# EAGLE design Adafruit PowerBoost 500C (EAGLE 6.3)
COMPANY: ADAFRUIT INDUSTRIES; DRAWN: KTOWN; REV: A
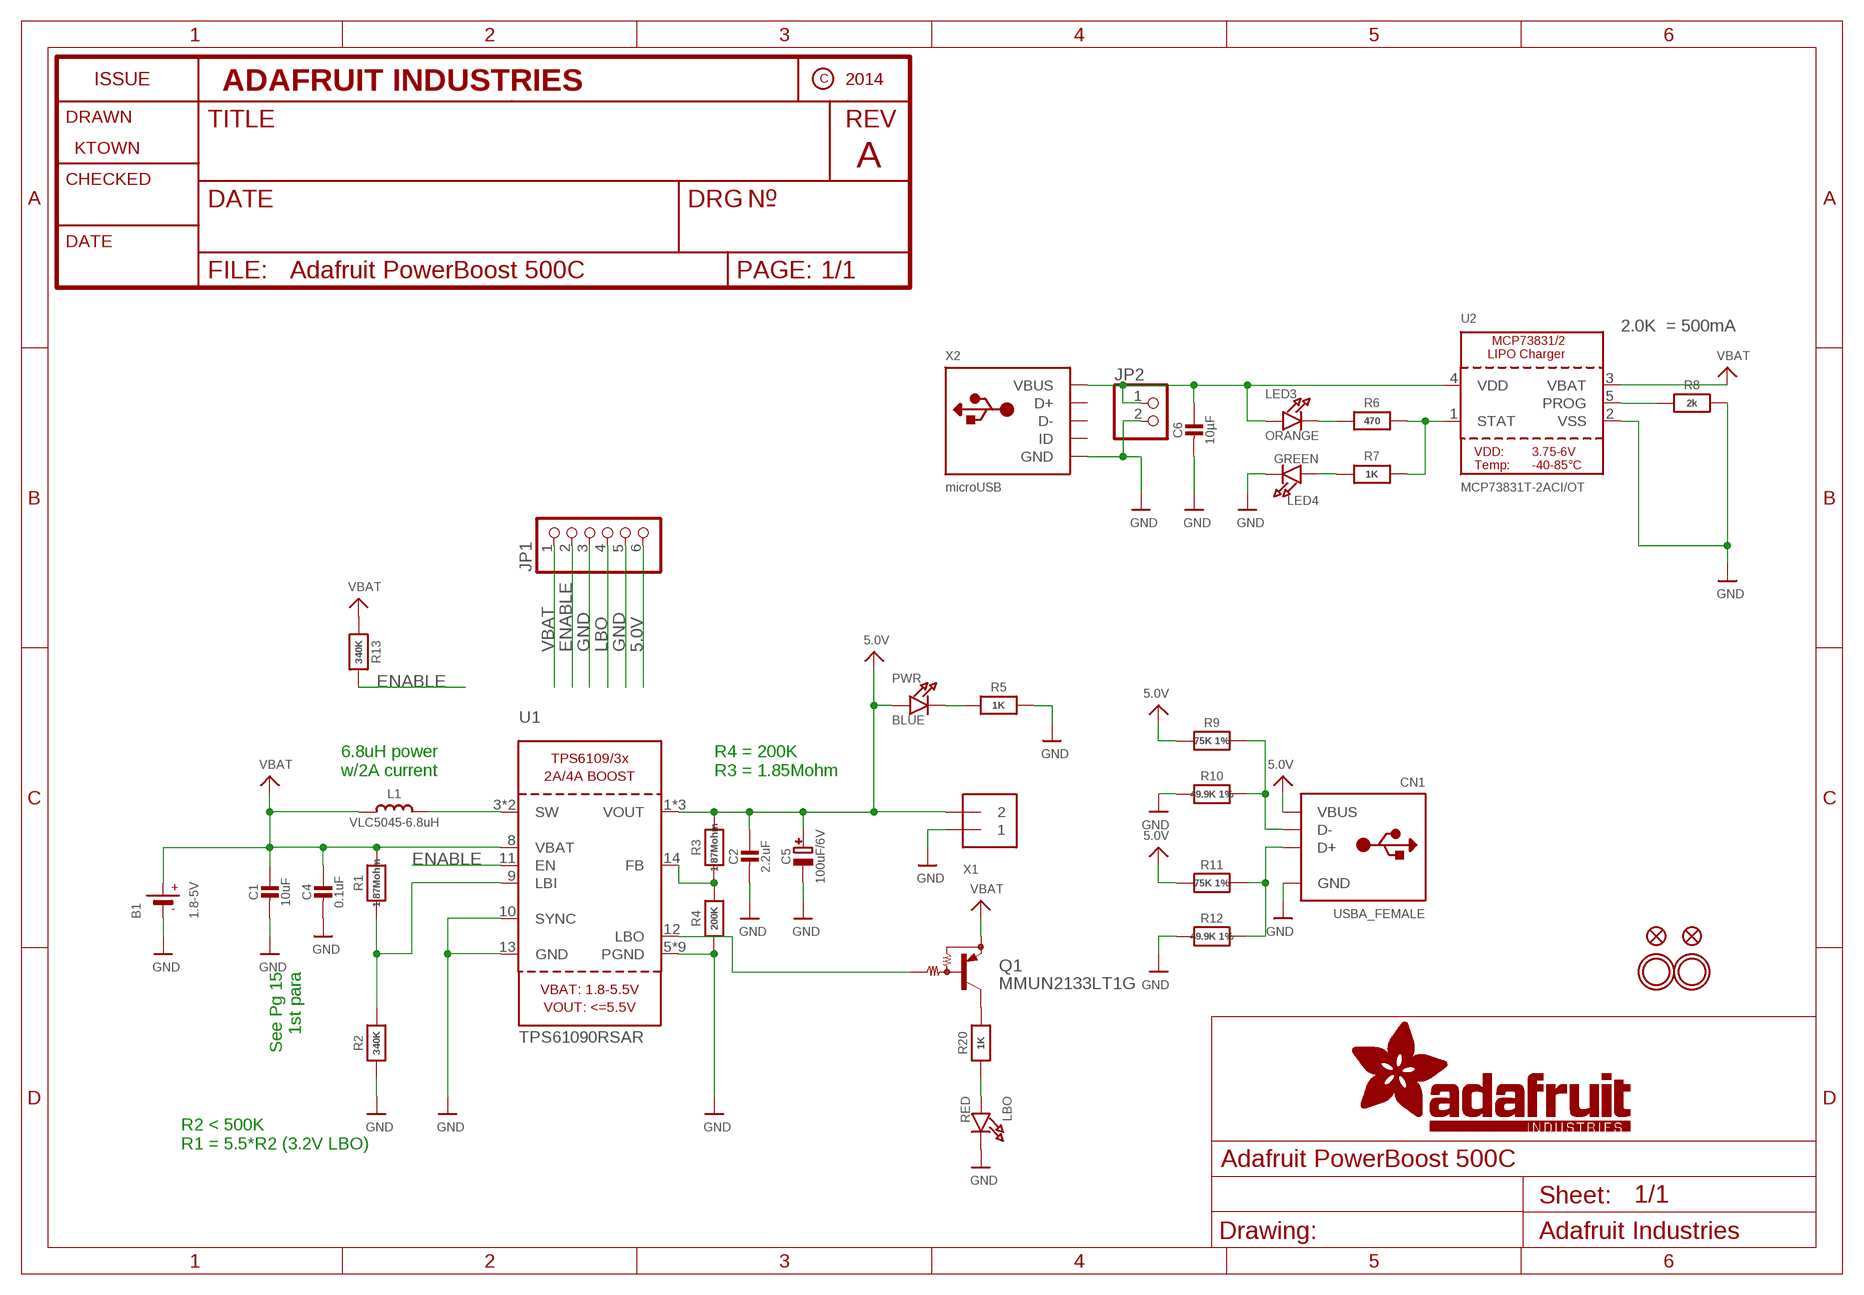
[diagram p0: schematic, sheet 1]

## Parts
B1  1.8-5V  BATTERY  [JSTPH2]
C1  10uF  CAP_CERAMIC0805-NOOUTLINE  [0805-NO]
C2  2.2uF  CAP_CERAMIC0805-NOOUTLINE  [0805-NO]
C4  0.1uF  CAP_CERAMIC0805-NOOUTLINE  [0805-NO]
C5  100uF/6V  CAP_TANTALUMB/3528_REFLOW  [EIA3528-21/B-R]
C6  10µF  CAP_CERAMIC0805-NOOUTLINE  [0805-NO]
CN1  USBA_FEMALE  USB_TYPEAPTHFML  [USB_HOST-PTH]
FID2  FIDUCIAL""  [FIDUCIAL_1MM]
FID3  FIDUCIAL""  [FIDUCIAL_1MM]
JP1  PINHD-1X6CB  [1X06-CLEANBIG]
JP2  HEADER-1X2ROUND  [1X02_ROUND]
L1  VLC5045-6.8uH  INDUCTORTDK_VLC5045  [INDUCTOR_5X5MM_TDK_VLC5045]
LBO  RED  LED0805_NOOUTLINE  [CHIPLED_0805_NOOUTLINE]
LED3  ORANGE  LED0805_NOOUTLINE  [CHIPLED_0805_NOOUTLINE]
LED4  GREEN  LED0805_NOOUTLINE  [CHIPLED_0805_NOOUTLINE]
PWR  BLUE  LED0805_NOOUTLINE  [CHIPLED_0805_NOOUTLINE]
Q1  MMUN2133LT1G  MUN2114T1-PNP_DRIVER-SC59-BEC  [SC59-BEC]
R1  1.87Mohm  RESISTOR0805_NOOUTLINE  [0805-NO]
R2  340K  RESISTOR0805_NOOUTLINE  [0805-NO]
R3  1.87Mohm  RESISTOR0805_NOOUTLINE  [0805-NO]
R4  200K  RESISTOR0805_NOOUTLINE  [0805-NO]
R5  1K  RESISTOR0805_NOOUTLINE  [0805-NO]
R6  470  RESISTOR0805_NOOUTLINE  [0805-NO]
R7  1K  RESISTOR0805_NOOUTLINE  [0805-NO]
R8  2k  RESISTOR0805_NOOUTLINE  [0805-NO]
R9  75K 1%  RESISTOR0805_NOOUTLINE  [0805-NO]
R10  49.9K 1%  RESISTOR0805_NOOUTLINE  [0805-NO]
R11  75K 1%  RESISTOR0805_NOOUTLINE  [0805-NO]
R12  49.9K 1%  RESISTOR0805_NOOUTLINE  [0805-NO]
R13  340K  RESISTOR0805_NOOUTLINE  [0805-NO]
R20  1K  RESISTOR0805_NOOUTLINE  [0805-NO]
U1  TPS61090RSAR  VREG_TPS6103X  [PVQFN-16]
U2  MCP73831T-2ACI/OT  MCP73831/2  [SOT23-5]
U$10  MOUNTINGHOLE2.5  [MOUNTINGHOLE_2.5_PLATED]
U$12  MOUNTINGHOLE2.5  [MOUNTINGHOLE_2.5_PLATED]
X1  TERMBLOCK_1X2  [TERMBLOCK_1X2-3.5MM]
X2  microUSB  USBMICRO_20329  [4UCONN_20329]

## Nets
5.0V: C2.1 C5.+ CN1.VBUS JP1.6 PWR.A R3.2 R9.2 R11.2 U1.1(VOUT) U1.15(VOUT) U1.16(VOUT) X1.2
D+: CN1.D+ R11.1 R12.1
D-: CN1.D- R9.1 R10.1
ENABLE: JP1.2 R13.2 U1.11(EN)
GND: B1.1(-) C1.2 C2.2 C4.2 C5.- C6.2 CN1.GND JP1.3 JP1.5 JP2.2 LBO.C LED4.C R2.1 R4.1 R5.2 R8.2 R10.2 R12.2 U1.5(PGND) U1.6(PGND) U1.7(PGND) U1.10(SYNC) U1.13(GND) U1.P$18(PGND) U1.P$19(PGND) U1.P$20(PGND) U1.P$21(PGND) U1.P$22(PGND) U1.THERMAL(PGND) U2.2(VSS) X1.1 X2.BASE@1(GND) X2.BASE@2(GND) X2.GND X2.SPRT@1(GND) X2.SPRT@2(GND) X2.SPRT@3(GND) X2.SPRT@4(GND)
LBO: JP1.4 Q1.B U1.12(LBO)
N$1: L1.P$2 U1.3(SW) U1.4(SW)
N$2: LBO.A R20.1
N$3: R1.1 R2.2 U1.9(LBI)
N$4: PWR.C R5.1
N$5: R3.1 R4.2 U1.14(FB)
N$6: LED3.C R6.1
N$7: R6.2 R7.2 U2.1(STAT)
N$8: R8.1 U2.5(PROG)
N$9: LED4.A R7.1
N$10: Q1.C R20.2
VBAT: B1.2(+) C1.1 C4.1 JP1.1 L1.P$1 Q1.E R1.2 R13.1 U1.8(VBAT) U2.3(VBAT)
VDD1: C6.1 JP2.1 LED3.A U2.4(VDD) X2.VBUS
Unconnected: X2.D+ X2.D- X2.ID

## Notes on the sheet
- 2.0K  = 500mA
- 6.8uH power
  w/2A current
- R4 = 200K
  R3 = 1.85Mohm
- See Pg 15
  1st para
- R2 < 500K
  R1 = 5.5*R2 (3.2V LBO)

## Library data of the parts
B1 = microbuilder:BATTERY: CR1220 SMT - Digikey: 3001K-ND CD2032 BAT-HLD-001 - Digikey: BAT-HLD-001-ND
C1 C2 C4 C6 = microbuilder:CAP_CERAMIC: Ceramic Capacitors For new designs, use the packages preceded by an '_' character since they are more reliable: The following footprints should be used on most boards: _0402 - Standard footprint for regular board layouts _0603 - Standard footprint for regular board layouts _0805 - Standard footprint for regular board layouts _1206 - Standard footprint for regular board layouts For extremely tight-pitch boards where space is at a premium, the following 'micro-pitch' footprints can be used (smaller pads, no silkscreen outline, etc.): _0402MP - Micro-pitch footprint for very dense/compact boards _0603MP - Micro-pitch footprint for very dense/compact boards _0805MP - Micro-pitch footprint for very dense/compact boards _1206MP - Micro-pitch footprint for very dense/compact boards
C5 = microbuilder:CAP_TANTALUM: Tantalum Capacitors Wave footprints have larger pads and are meant to be used for hand soldering. Reflow footprints are optimised for solder paste and a reflow oven. EIA3216-18/A-[R/W] - Size A / 3216-18 / 1206 footprint 4.7µF 25V 10% Tantalum Capacitor 10µF 16V 10% Tantalum Capacitor [Digikey: 495-2236-2-ND] EIA3528-21/B-[R/W] - Size B / 3528-21 47µF 10V 10% Tantalum Capactior [Digikey: 495-2216-1-ND] EIA6032-28/C-[R/W] - Size C / 6032-28 10µF 35V 20% Tantalum Capacitor [Digikey: 495-2285-1-ND] 100µF 16V 10% Tantalum Capactior [Digikey: 399-5214-1-ND]
CN1 = microbuilder:USB_TYPEA: USB - Type A Connectors Male types stick out and are inserted into a PC or matching females parts (these are the connectors used on USB Memory Sticks, etc.). Female parts are generally used for USB Host and accept a male-type connector. SMT - 4UCON: 10017 PTHFML - Digikey: 609-1045-ND, 4UCon: 05241 PCB - Use 2.0mm thick PCBs with this footprint
FID2 FID3 = microbuilder:FIDUCIAL: Fiducial Alignment Points Various fiducial points for machine vision alignment.; BOM: EXCLUDE
JP1 = adafruit:PINHD-1X6: PIN HEADER
JP2 = microbuilder:HEADER-1X2: PIN HEADER
L1 = microbuilder:INDUCTOR: Inductors 0603: 10nH Ceramic Inductor - microwire antenna/RF (Digikey: 712-1434-2-ND) 0805: 560nH Ceramic Inductor - RF (Digikey: 553-1047-1-ND) 270nH Ceramic Inductor - Q = 40@250MHz, +-5%, 1 Ohm DC Resistance (Digikey: 535-10506-2-ND) 1007 (2518 Metric) SMT: 10µH 10% 250mOhm 820mA 1007 Inductor (Digikey: 587-2189-1-ND) 22µH 10% 500mOhm 580mA 1007 Inductor (Digikey: 587-2190-1-ND) 47µH 10% 950mOhm 420mA 1007 Inductor (Digikey: 587-2191-1-ND) 47µH 5% 100mOhm 1A 1008 Inductor (Digikey: 732-1816-1-ND) 5.0x5.0mm (Taiyo Yuden NR5040 Series) 6.8µH 20% 2.3A 64mOhm Inductor (Digikey: 587-2374-2-ND) 5.0x5.0mm (TDK VLC5045 Series) 4.7µH 20% 3.3A 34mOhm Inductor (Digikey: 445-6526-1-ND) 6.8µH 20% 2.7A 46mOhm Inductor (Digikey: 445-6527-1-ND) 6.0x6.0mm (TDK VLC6045 Series) 4.7µH 20% 3.8A 27mOhm Inductor (Digikey: 445-6538-2-ND) 6.8µH 20% 3A 41mOhm Inductor (Digikey: 445-6540-1-ND) 6.2µH 30% 2.2A 45mOhm Inductor (Digikey: SRR5028-6R2YCT-ND) - Not TDK VLC6045 but footprint should match 6.0x6.0mm (TDK SLF6045 Series) 6.8uH 30% 2A 33mOhm Inductor (Digikey: 445-4572-1-ND, Mouser: 810-SLF645T6R8N2R0PF) 6.0x6.0mm (Sumida CDRH5D28 Series) 6.2uH 30% 1.8A 45mOhm Inductor (Digikey: 308-1542-1-ND) Taiyo Yuden NR3015T2R2M - 2.2uH 20% 1.5A (Digikey: 587-1648-2-ND, Mouser: 963-NR3015T2R2M) - Used with TI TPS62172 CoilCraft RFID Transponder Coil - MA5532-AE (For use with AS3935 Lightning Sensor)
LBO LED3 LED4 PWR = microbuilder:LED: LED 0603 - 0603 Surface Mount Package 2mA: Green LED - Low Power (3.9mcd, 2ma, 1.7Vf) - Digikey: 475-2709-2-ND Orange LED - Low Power (9.8mcd, 2ma, 1.8Vf) - Digikey: 475-1194-2-ND Red LED - Low Power (5mcd, 2ma, 1.8Vf) - Digikey: 475-1195-2-ND Yellow LED - Low Power (7mcd, 2ma, 1.8Vf) - Digikey: 475-1196-2-ND 5mA: Blue LED - Low Power (17mcd, 5ma, 2.9Vf) - Digikey: LNJ937W8CRACT-ND 0805 - 0805 Surface Mount Package 2mA: Red LED (8.8mcd, 2mA, 1.8Vf, Clear) - Low Power [Digikey: 475-2510-1-ND] Green LED (5mcd, 2mA, 1.8Vf, Clear) - Low Power [Digikey: 475-2730-1-ND] Yellow LED (11.3mcd, 2mA, 1.8Vf, Clear) - Low Power [Digikey: 475-2555-1-ND] 20mA: Red LED (104mcd, 20mA, Diffused) - LS R976 [Digikey: 475-1278-6-ND] Red LED (12mcd, 20mA, 2.0Vf, Clear) - APT2012EC [Digikey: 754-1128-1-ND] Green LED (15mcd, 20mA, 2.2Vf, Clear) - APT2012GC [Digikey: 754-1131-1-ND] Orange LED (160mcd, 20mA, 2.1Vf, Clear) - APT2012SECK [Digikey: 754-1130-1-ND] 1206 - 1206 Surface Mount Package Green LED (26mcd, 20mA, Diffused) - LG N971 [Digikey: 475-1407-6-ND] Red LED (15mcd, 20mA, Diffused) - LH N974 [Digikey: 475-1416-6-ND] Cree - Cree High-Power Surface Mount LEDs XPEBWT-L1-0000-00D50 - White 111lm 350mA 2.9Vf 6200K 110° XTEAWT-00-0000-00000LEE3 - White 114lm 350mA 2.85Vf 5000K 115° Everlight - Everlight 45-21 Series Surface Mount LEDs 45-21/QK2C-B2832AC2CB2/2T - Warm White 2000mcd 20mA 3.25Vf 3050K 120° 45-21/LK2C-B38452C4CB2/2T - Nuetral White 2000mcd 20mA 3.25Vf 4150K 120° 45-21/LK2C-B50634C6CB2/2T - Cold White 2200mcd 20mA 3.25Vf 5650K 120° PLCC2 Reverse Mount LS T77K-J1L2-1-0-2-R18-Z - Red 11.25mcd 2mA 1.8Vf 630nm 120° LO T77K-L1M2-24-Z - Orange 19.6mcd 2mA 1.8Vf 606nm 120° LY T77K-K2M1-26-Z - Yellow 15.7mcd 2mA 1.8Vf 587nm 120°
Q1 = transistor:*-PNP_DRIVER-: PNP Bias Resistor Transistor
R1-R13 R20 = microbuilder:RESISTOR: Resistors For new designs, use the packages preceded by an '_' character since they are more reliable: The following footprints should be used on most boards: _0402 - Standard footprint for regular board layouts _0603 - Standard footprint for regular board layouts _0805 - Standard footprint for regular board layouts _1206 - Standard footprint for regular board layouts For extremely tight-pitch boards where space is at a premium, the following 'micro-pitch' footprints can be used (smaller pads, no silkscreen outline, etc.): _0402MP - Micro-pitch footprint for very dense/compact boards _0603MP - Micro-pitch footprint for very dense/compact boards _0805MP - Micro-pitch footprint for very dense/compact boards _1206MP - Micro-pitch footprint for very dense/compact boards
U1 = microbuilder:VREG_TPS6103X: TPS6103x 4A Boost - 1.8-5.5V Input, Adjustable Output to 5.5V
U2 = microbuilder:MCP73831/2: MCP73831/2 LIPO Charger VDD: 3.75 - 6V Temp -40 - 85°C Programmable Charge Rate: 15-500mA NOTE: STAT is a tri-state logic output on the MCP73831 and an open-drain output on the MCP73832. SOT23-5 with 4.2V output and tri-state logic on STAT = MCP73831T-2ACI/OT
U$10 U$12 = microbuilder:MOUNTINGHOLE: Mounting Hole For #2 screws (0.086"/2.18mm width, 0.094"/2.4mm hole) use 2.5mm; BOM: EXCLUDE
X1 = microbuilder:TERMBLOCK_1X2: 3.5mm Terminal block http://www.ladyada.net/library/pcb/eaglelibrary.html
X2 = microbuilder:USB: USB Connectors USBMINIB - Surface Mount Female Mini-B USB Connector 4UConnector: 06564

## Board
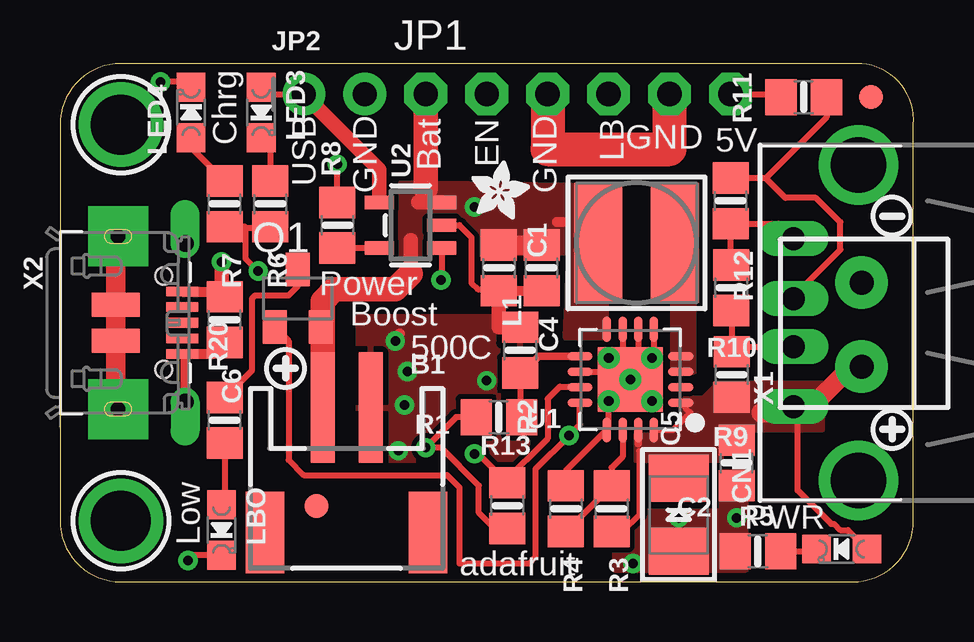
[diagram p1: board, top side]
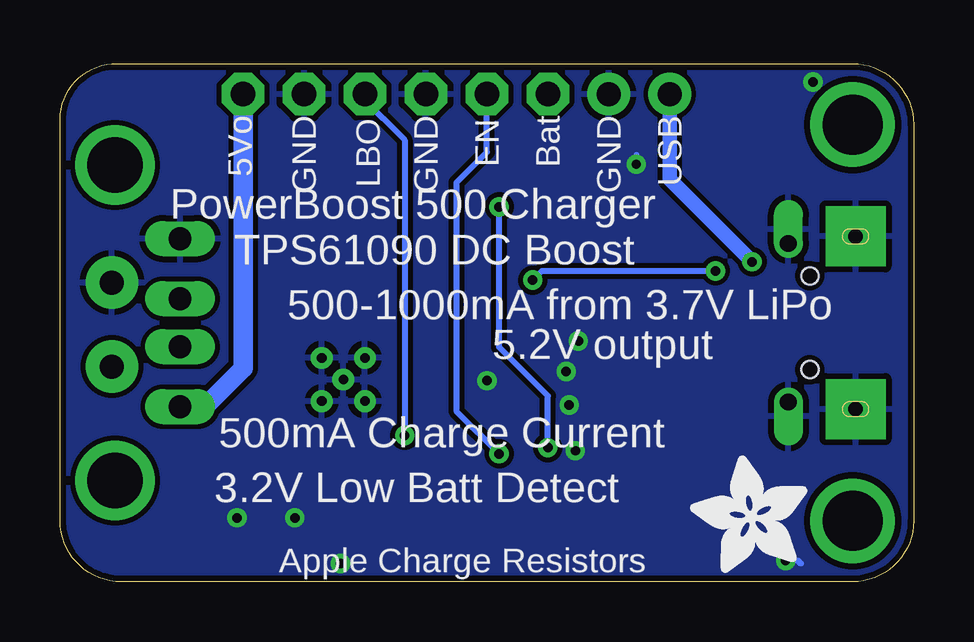
[diagram p2: board, bottom side, seen from below]

Size 35.57 x 21.59 mm. Coordinates in mm from the lower left corner, seen from the top.
Outline: 0,19.05 0,2.54 arc90 2.54,0 33.02,0 arc90 35.56,2.54 35.56,19.05 arc90 33.4,21.59 2.54,21.59 arc90 0,19.05
Copper layers (1*16): Top 0.035mm / dielectric 1.5mm / Bottom 0.035mm
Design rules "adafruit *": minimum track width 8mil, minimum drill 15.5mil, track to track 8mil, track to pad 8mil, pad to pad 8mil, via to via 8mil, smd to smd 8mil, copper to edge 10mil, drill to drill 8mil, minimum pad ring 10mil, minimum via ring 8mil, stop-mask expansion 2mil, vias tented up to drill 20mil, thermal gap 10mil

### Footprints (pad centres in the part's own frame; a part is rotated, then mirrored left to right if it is on the bottom)
JSTPH2 = smd 1 x 4.6: 1 -1,-3.7; 2 1,-3.7 | smd 1.6 x 3.4: NC1 -3.4,1.5; NC2 3.4,1.5
0805-NO = smd 1.3 x 1.5: 1 -0.95,0; 2 0.95,0
EIA3528-21/B-R = smd 1.95 x 2.5: + 1.525,0; - -1.525,0
USB_HOST-PTH = drill 0.95 long: D+ 1,6.52; D- -1,6.52; GND 3.5,6.52; VBUS -3.5,6.52 | drill 2.3 pad 2.9: S1 -6.57,3.81; S2 6.57,3.81
FIDUCIAL_1MM = smd 1 x 1: 1 0,0
1X06-CLEANBIG = drill 1.016 pad 1.778 octagon: 1 -6.35,0; 2 -3.81,0; 3 -1.27,0; 4 1.27,0; 5 3.81,0; 6 6.35,0
1X02_ROUND = drill 1 pad 1.778: 1 -1.27,0; 2 1.27,0
INDUCTOR_5X5MM_TDK_VLC5045 = smd 2 x 5: P$1 -1.6,0; P$2 1.6,0
CHIPLED_0805_NOOUTLINE = smd 1.2 x 1.2: A 0,-1.05; C 0,1.05
SC59-BEC = smd 1 x 1.4: B -0.95,-1.2; C 0,1.2; E 0.95,-1.2
PVQFN-16 = smd 1.05 x 0.35: 1 -2.1,0.975; 2 -2.1,0.325; 3 -2.1,-0.325; 4 -2.1,-0.975; 9 2.1,-0.975; 10 2.1,-0.325; 11 2.1,0.325; 12 2.1,0.975 | smd 0.35 x 1.05: 5 -0.975,-2.1; 6 -0.325,-2.1; 7 0.325,-2.1; 8 0.975,-2.1; 13 0.975,2.1; 14 0.325,2.1; 15 -0.325,2.1; 16 -0.975,2.1 | drill 0.4: P$18 0,0; P$19 -0.9,0.9; P$20 0.9,0.9; P$21 0.9,-0.9; P$22 -0.9,-0.9 | smd 2.7 x 2.7: THERMAL 0,0
SOT23-5 = smd 0.55 x 1.2: 1 -0.95,-1.3; 2 0,-1.3; 3 0.95,-1.3; 4 0.95,1.3; 5 -0.95,1.3
MOUNTINGHOLE_2.5_PLATED = drill 2.5 pad 3.2: P$1 0,0
TERMBLOCK_1X2-3.5MM = drill 1 pad 2.184: 1 1.8,0; 2 -1.7,0
4UCONN_20329 = smd 1 x 2: BASE@1 -0.75,-2; BASE@2 0.75,-2 | smd 0.4 x 1.35: D+ 0,0.775; D- -0.65,0.775; GND 1.3,0.775; ID 0.65,0.775; VBUS -1.3,0.775 | drill 0.7 offset: SPRT@1 -3.3,0.9; SPRT@2 3.3,0.9 | drill 0.6 pad 2.5 square: SPRT@3 -3.6,-1.9; SPRT@4 3.6,-1.9 | hole 0.7: -1.95,0; 1.95,0

### Placement (x,y rotation side)
B1  11.94,3.56 180 top
C1  18.29,13.08 270 top
C2  28.19,4.95 270 top
C4  20.07,13.08 270 top
C5  25.78,2.79 90 top
C6  6.86,10.92 270 top
CN1  37.08,10.79 90 top
FID2  10.69,3.15 0 top
FID3  33.78,20.19 0 top
JP1  21.59,20.32 0 top
JP2  11.43,20.32 0 top
L1  24.02,14.13 0 top
LBO  6.73,2.16 180 top
LED3  8.38,19.56 180 top
LED4  5.46,19.56 0 top
PWR  32.57,1.36 90 top
Q1  9.91,11.81 0 top
R1  18.29,6.86 180 top
R2  19.18,9.65 270 top
R3  22.99,3.05 270 top
R4  21.08,3.05 270 top
R5  29.08,1.27 180 top
R6  8.76,15.75 270 top
R7  6.86,15.75 270 top
R8  11.56,14.86 90 top
R9  27.99,8.64 270 top
R10  27.97,12.25 90 top
R11  30.99,20.19 180 top
R12  27.94,15.88 270 top
R13  18.64,3.17 90 top
R20  6.86,6.73 90 top
U1  23.76,8.43 180 top
U2  14.61,14.86 90 top
U$10  2.54,19.05 0 top
U$12  2.54,2.54 0 top
U$13  [SYMBOL_PLUS]  9.4,8.89 0 top
U$25  [SYMBOL_PLUS]  34.67,6.35 0 top
U$26  [SYMBOL_MINUS]  34.67,15.24 0 top
U$28  [ADAFRUIT_2.5MM]  17.14,15.11 0 top
U$29  [ADAFRUIT_5MM]  4.45,0.38 90 bottom
X1  33.4,10.67 90 top
X2  4.32,10.79 270 top

### Tracks (layer width: path | path; a pad name or v marks a point on that pad's centre or on a via)
5.0V
  Top 0.254: U1.1 26.27,7.05 25.55,6.33 U1.16 | 29.46,6.79 29.21,7.05 | JP1.6 29.91,20.32 R11.2 | 24.13,5.46 24.13,2.79 23.43,2.1 R3.2 | CN1.VBUS 30.73,7.12 30.73,3.81 32.13,2.41 32.26,2.41 32.51,2.16 32.83,2.16 PWR.A
  Top 0.305: U1.15 24.09,5.76
  Top 0.813: 29.21,7.05 30.06,7.05 | 30.62,6.99 30.99,6.99 32.97,8.97 X1.2
  Bottom 0.813: JP1.6 27.94,8.89 29.54,7.29 CN1.VBUS
  pour Top (no thermals): 24,6.1 24,5.08 27.56,5.08 27.56,6.35 31.75,6.35 31.75,8.26 27.3,8.26 27.3,8.13 26.8,7.62 26.04,7.62 26.04,6.6 25.53,6.1
D+
  Top 0.254: R11.1 31.94,19.36 29.4,16.82 | 29.4,16.82 R12.1 | 30.34,11.79 CN1.D+ 30.56,11.89 32.51,13.84 32.51,14.99 31.5,16 30.22,16 29.4,16.82
D-
  Top 0.254: CN1.D- 28.2,9.79 R9.1 27.99,11.29 R10.1
ENABLE  (via drill 0.39)
  Top 0.254: U1.11 21.64,8.13 20.83,8.13 20.32,7.62 20.32,5.97 18.48,4.12 R13.2 | 18.7,4.06 R13.2 | v17.27,5.33 17.43,5.33 R13.2
  Bottom 0.254: v17.27,5.33 19.05,7.11 19.05,16.64 17.78,17.91 JP1.2
GND  (via drill 0.39)
  Top 0.254: U1.P$21 23.27,8.92 | 23.27,8.92 U1.THERMAL | U1.THERMAL 24.24,8.91 | 24.24,8.91 U1.P$22 24.74,9.4 U1.5 | U1.THERMAL U1.P$19 | U1.THERMAL U1.P$20 22.86,6.4 U1.13 21.08,4.62 R4.1 | U1.10 23.44,8.75 U1.THERMAL | U1.7 23.44,9.09 23.27,8.92 | U1.6 24.09,9.06 24.24,8.91 | R10.2 27.94,13.23 R12.2 29.93,14.93 CN1.GND | LBO.C 5.55,1.11 v5.33,0.89 | LED4.C 5.24,20.83 v4.19,20.83 | R8.2 v11.56,17.4 | U2.2 16.64,14.86 17.14,14.35 17.14,12.45 17.4,12.19 18.23,12.19 C1.2
  Top 0.406: C1.2 C4.2 | C6.2 6.38,9.49 X2.GND 5.22,9.37 X2.SPRT@2 | 14.16,10.35 14.1,10.29
  Top 0.61: R2.1 18.29,10.6 C1.2
  Top 0.813: X2.SPRT@4 2.32,7.29 X2.BASE@2 X2.BASE@1 2.32,14.38 2.41,14.48
  Top 1.422: JP1.3 20.32,18.03 25.4,18.03 JP1.5
  Bottom 0.254: v5.33,0.89 4.83,0.89 4.7,0.76 | v4.19,20.83 4.06,20.7 | v11.56,17.4 11.56,17.78
  other vias: 14.35,7.37 25.78,2.67 17.78,8.38 23.88,0.76 28.19,2.67 13.97,10.03 14.1,5.46 14.48,8.76
  pour Bottom: 0,22.1 0,0 35.56,0 36.2,22.1
  pour Top (no thermals): 23.11,2.92 23.11,0.51 28.57,0.51 28.57,4.57 27.56,4.57 27.56,2.92
  pour Top: 12.45,11.05 19.56,11.05 19.56,4.95 12.45,5.08
LBO  (via drill 0.39)
  Top 0.254: U1.12 21.66,6.55 v21.21,6.1 19.81,4.7 19.81,1.02 19.56,0.76 16.64,0.76 16.64,3.94 16.13,4.45 10.16,4.45 9.53,5.08 9.53,10.04 Q1.B
  Bottom 0.254: JP1.4 22.99,20.19 21.21,18.41 v21.21,6.1
N$1
  pour Top (no thermals): 25.53,8.76 26.42,8.76 26.42,16 25.02,16 25.02,12.19 25.53,11.68
N$2
  Top 0.254: R20.1 6.86,3.34 LBO.A
N$3
  Top 0.254: R2.2 19.18,6.92
  Top 0.305: U1.9 19.94,9.4 19.24,8.7 R2.2
  Top 0.61: 19.18,6.92 R1.1
N$4
  Top 0.254: R5.1 31.11,1.27 31.2,1.36 PWR.C
N$5
  Top 0.254: U1.14 23.44,5.21 22.99,4.76 R3.1 | R3.1 22.86,3.87 | R4.2 R3.1
N$6
  Top 0.254: LED3.C 8.76,18.13 R6.1
N$7  (via drill 0.39)
  Top 0.254: v8.26,12.95 7.74,13.47 7.75,13.48 7.75,14.73 | 7.75,14.73 7.68,14.8 R7.2 | R6.2 8.7,14.73 7.75,14.73 | U2.1 15.9,12.6 v15.88,12.57
  Bottom 0.254: v15.88,12.57 15.49,12.95 v8.26,12.95
N$8
  Top 0.254: U2.5 R8.1
N$9
  Top 0.254: R7.1 5.46,18.09 LED4.A
N$10
  Top 0.254: R20.2 8,8.82 8,11.81 8.13,11.94 9.53,11.94 9.91,12.32 Q1.C
VBAT  (via drill 0.39)
  Top 0.254: 18.21,2.22 R13.1 18.1,2.22 17.45,2.87 17.45,4.01 15.88,5.59 v15.24,5.59 16.51,6.86 R1.2 | 10.94,10.95 10.94,11.18
  Top 0.406: 20.7,15 20.97,15
  Top 0.61: 14.92,15.81 U2.3 | Q1.E 10.88,10.61 10.94,10.67 | 14.61,12.83 14.61,14.22
  Top 0.813: C4.1 C1.1
  Top 1.016: B1.2 10.94,10.67 10.94,11.18 10.94,11.7 11.43,12.19 13.97,12.19 14.61,12.83 | JP1.1 15.24,16.38
  Bottom 0.254: v15.24,5.59 15.24,7.75 17.27,9.78 v17.27,15.62
  pour Top (no thermals): 14.22,16.64 22.73,16.51 22.73,10.16 21.08,10.16 21.21,13.72 14.22,13.59
VDD1  (via drill 0.39)
  Top 0.254: LED3.A 8.67,20.32 JP2.1
  Top 0.406: X2.VBUS 6.63,12.1 C6.1
  Top 0.61: C6.1 6.73,12 v6.73,13.34 | U2.4 13.3,17.18 JP2.1
  Bottom 0.61: v6.73,13.34 10.16,16.76 JP2.1

### Text on the board
tPlace: Chrg | USB | GND | Bat | EN | GND | LB | GND | 5V | Power | Boost | 500C | PWR | Low | adafruit
bPlace: USB | GND | Bat | EN | GND | LBO | GND | 5Vo | PowerBoost 500 Charger | TPS61090 DC Boost | 500-1000mA from 3.7V LiPo | 5.2V output | 500mA Charge Current | 3.2V Low Batt Detect | Apple Charge Resistors